# EAGLE design elec - pi pico (EAGLE 9.6.2)
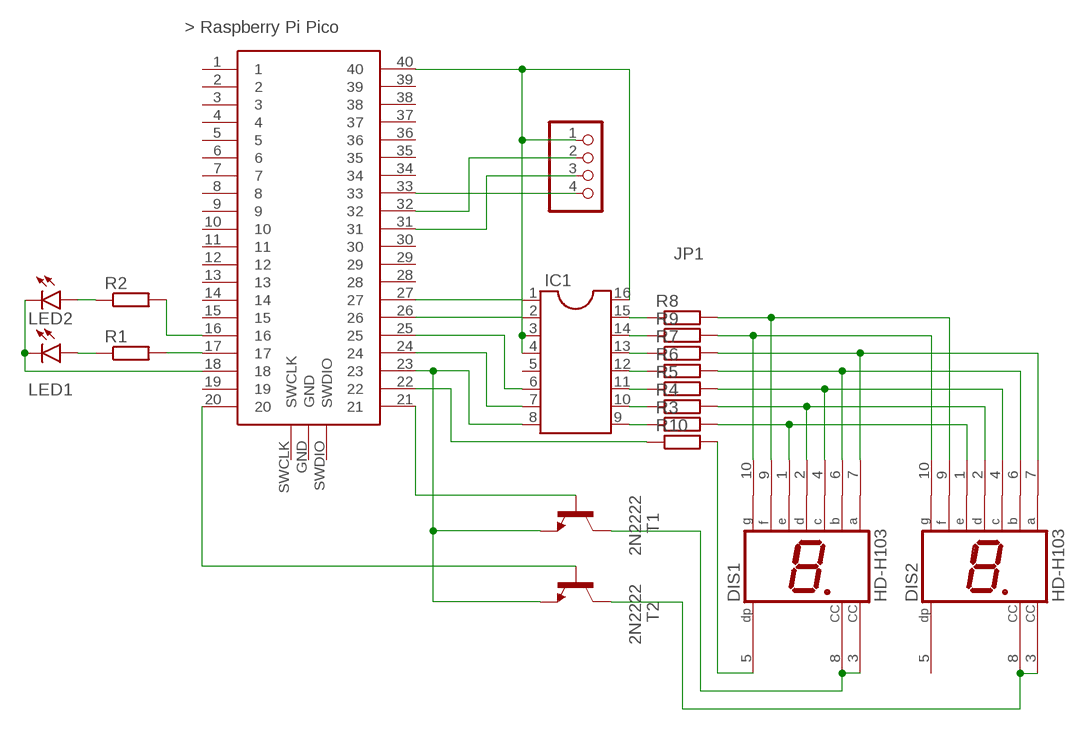
[diagram p0: schematic, sheet 1]

## Parts
DIS1  HD-H103  [HDSP-M]
DIS2  HD-H103  [HDSP-M]
IC1  DIL16  [DIL16]
JP1  PINHD-1X4  [1X04]
LED1  LED5MM  [LED5MM]
LED2  LED5MM  [LED5MM]
R1  R-EU_0204/2V  [0204V]
R2  R-EU_0204/2V  [0204V]
R3  R-EU_0204/2V  [0204V]
R4  R-EU_0204/2V  [0204V]
R5  R-EU_0204/2V  [0204V]
R6  R-EU_0204/2V  [0204V]
R7  R-EU_0204/2V  [0204V]
R8  R-EU_0204/2V  [0204V]
R9  R-EU_0204/2V  [0204V]
R10  R-EU_0204/2V  [0204V]
T1  2N2222  [TO18]
T2  2N2222  [TO18]
U$1  RASPBERRY-PI-PICO_TH  [FT_RASPBERRY-PI-PICO_TH]

## Nets
N$1: IC1.15 R8.1
N$2: IC1.14 R9.1
N$3: IC1.13 R7.1
N$4: IC1.12 R6.1
N$5: IC1.11 R5.1
N$6: IC1.10 R4.1
N$7: IC1.9 R3.1
N$8: IC1.1 U$1.27
N$9: IC1.2 U$1.26
N$10: IC1.6 U$1.25
N$11: IC1.7 U$1.24
N$12: DIS1.9(F) DIS2.9(F) R8.2
N$13: DIS1.10(G) DIS2.10(G) R9.2
N$14: DIS1.7(A) DIS2.7(A) R7.2
N$15: DIS1.6(B) DIS2.6(B) R6.2
N$16: DIS1.4(C) DIS2.4(C) R5.2
N$17: DIS1.2(D) DIS2.2(D) R4.2
N$18: DIS1.1(E) DIS2.1(E) R3.2
N$19: IC1.3 IC1.4 IC1.16 JP1.1 U$1.40
N$20: IC1.8 T1.1(E) T2.1(E) U$1.23
N$21: JP1.2 U$1.32
N$22: JP1.3 U$1.31
N$23: JP1.4 U$1.33
N$24: DIS1.3(CC) DIS1.8(CC) T1.3(C)
N$25: DIS2.3(CC) DIS2.8(CC) T2.3(C)
N$26: DIS1.5(DP) R10.2
N$27: R10.1 U$1.22
N$28: T2.2(B) U$1.20
N$29: R1.2 U$1.17
N$30: T1.2(B) U$1.21
N$31: R2.2 U$1.16
N$32: LED2.A R2.1
N$33: LED1.A R1.1
N$34: LED1.K(C) LED2.K(C) U$1.18
Unconnected: DIS2.5(DP) IC1.5 U$1.1 U$1.2 U$1.3 U$1.4 U$1.5 U$1.6 U$1.7 U$1.8 U$1.9 U$1.10 U$1.11 U$1.12 U$1.13 U$1.14 U$1.15 U$1.19 U$1.28 U$1.29 U$1.30 U$1.34 U$1.35 U$1.36 U$1.37 U$1.38 U$1.39 U$1.GND U$1.SWCLK U$1.SWDIO

## Library data of the parts
DIS1 DIS2 = display-hp:HD-H103: LED DISPLAY 1-character 7 segment, decimal point right; OC_FARNELL: unknown; OC_NEWARK: unknown
IC1 = ic-package:DIL16: Dual In Line / Socket
JP1 = pinhead:PINHD-1X4: PIN HEADER
LED1 LED2 = led:LED: LED OSRAM: - CHIPLED LG R971, LG N971, LY N971, LG Q971, LY Q971, LO R971, LY R971 LH N974, LH R974 LS Q976, LO Q976, LY Q976 LO Q996 - Hyper CHIPLED LW Q18S LB Q993, LB Q99A, LB R99A - SideLED LS A670, LO A670, LY A670, LG A670, LP A670 LB A673, LV A673, LT A673, LW A673 LH A674 LY A675 LS A676, LA A676, LO A676, LY A676, LW A676 LS A679, LY A679, LG A679 - Hyper Micro SIDELED® LS Y876, LA Y876, LO Y876, LY Y876 LT Y87S - SmartLED LW L88C, LW L88S LB L89C, LB L89S, LG L890 LS L89K, LO L89K, LY L89K LS L896, LA L896, LO L896, LY L896 - TOPLED LS T670, LO T670, LY T670, LG T670, LP T670 LSG T670, LSP T670, LSY T670, LOP T670, LYG T670 LG T671, LOG T671, LSG T671 LB T673, LV T673, LT T673, LW T673 LH T674 LS T676, LA T676, LO T676, LY T676, LB T676, LH T676, LSB T676, LW T676 LB T67C, LV T67C, LT T67C, LS T67K, LO T67K, LY T67K, LW E67C LS E67B, LA E67B, LO E67B, LY E67B, LB E67C, LV E67C, LT E67C LW T67C LS T679, LY T679, LG T679 LS T770, LO T770, LY T770, LG T770, LP T770 LB T773, LV T773, LT T773, LW T773 LH T774 LS E675, LA E675, LY E675, LS T675 LS T776, LA T776, LO T776, LY T776, LB T776 LHGB T686 LT T68C, LB T68C - Hyper Mini TOPLED® LB M676 - Mini TOPLED Santana® LG M470 LS M47K, LO M47K, LY M47K Source: http://www.osram.convergy.de LUXEON: - LUMILED® LXK2-PW12-R00, LXK2-PW12-S00, LXK2-PW14-U00, LXK2-PW14-V00 LXK2-PM12-R00, LXK2-PM12-S00, LXK2-PM14-U00 LXK2-PE12-Q00, LXK2-PE12-R00, LXK2-PE12-S00, LXK2-PE14-T00, LXK2-PE14-U00 LXK2-PB12-K00, LXK2-PB12-L00, LXK2-PB12-M00, LXK2-PB14-N00, LXK2-PB14-P00, LXK2-PB14-Q00 LXK2-PR12-L00, LXK2-PR12-M00, LXK2-PR14-Q00, LXK2-PR14-R00 LXK2-PD12-Q00, LXK2-PD12-R00, LXK2-PD12-S00 LXK2-PH12-R00, LXK2-PH12-S00 LXK2-PL12-P00, LXK2-PL12-Q00, LXK2-PL12-R00 Source: www.luxeon.com KINGBRIGHT: KA-3528ASYC Source: www.kingbright.com
R1-R10 = rcl:R-EU_: RESISTOR, European symbol; SPICEPREFIX: R
T1 T2 = transistor:2N2222: NPN TRANSISTOR
U$1 = pipico:RASPBERRY-PI-PICO_TH: Raspberry Pi Pico microcontroller board for through-hole mounting.

## Board
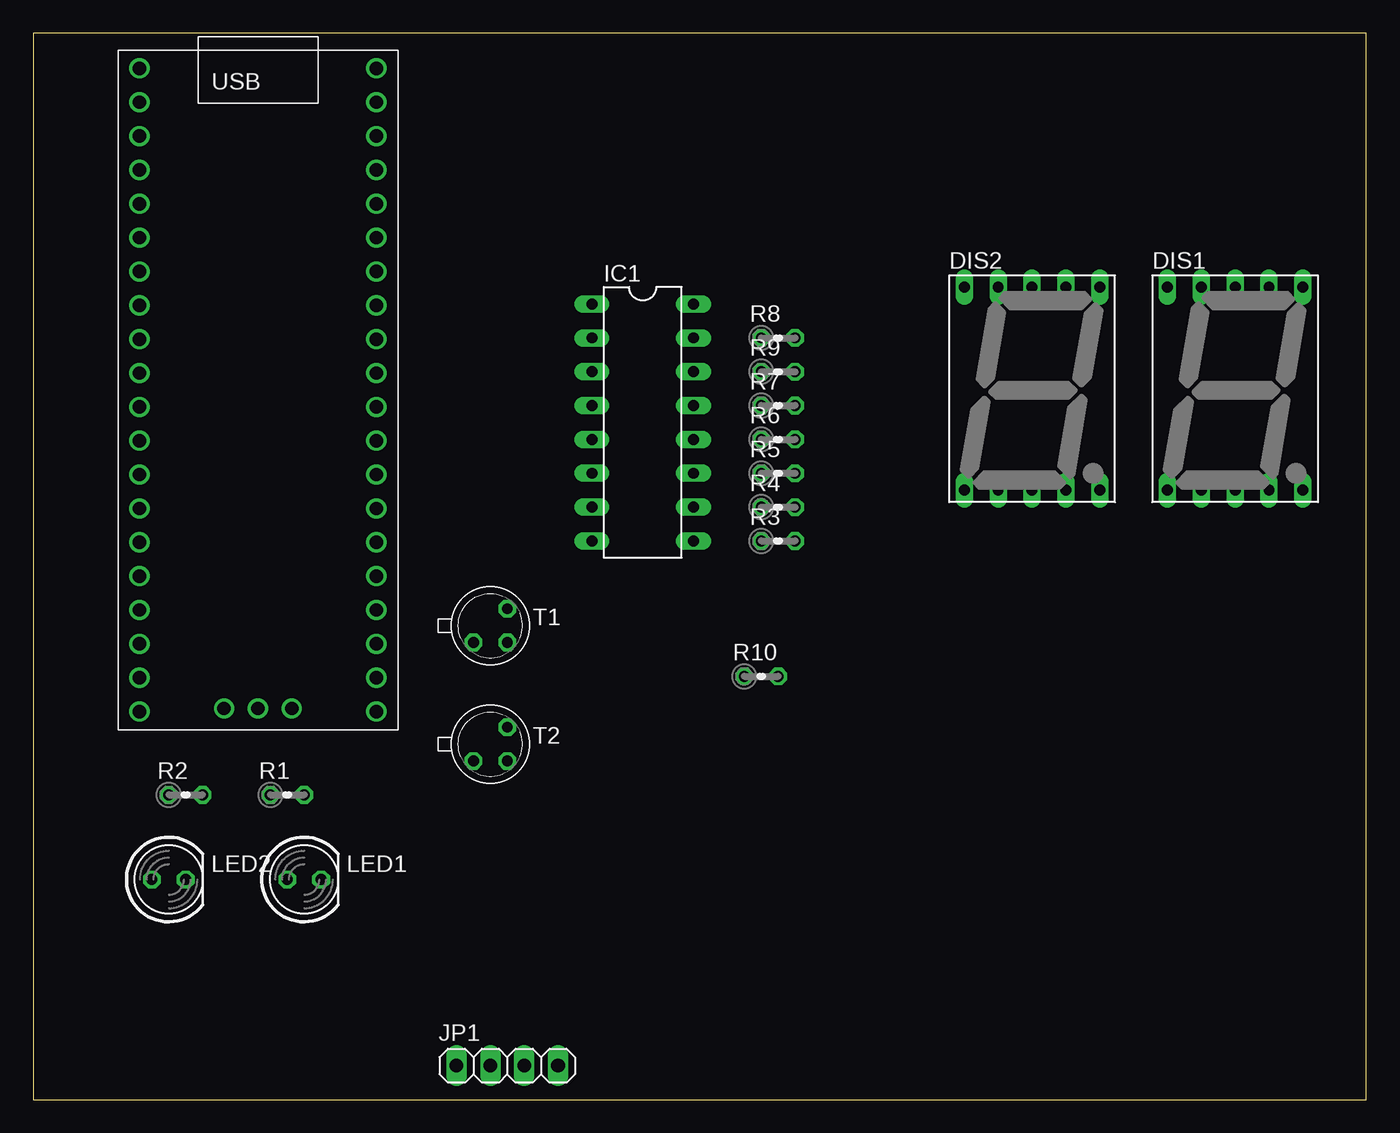
[diagram p1: board, top side]
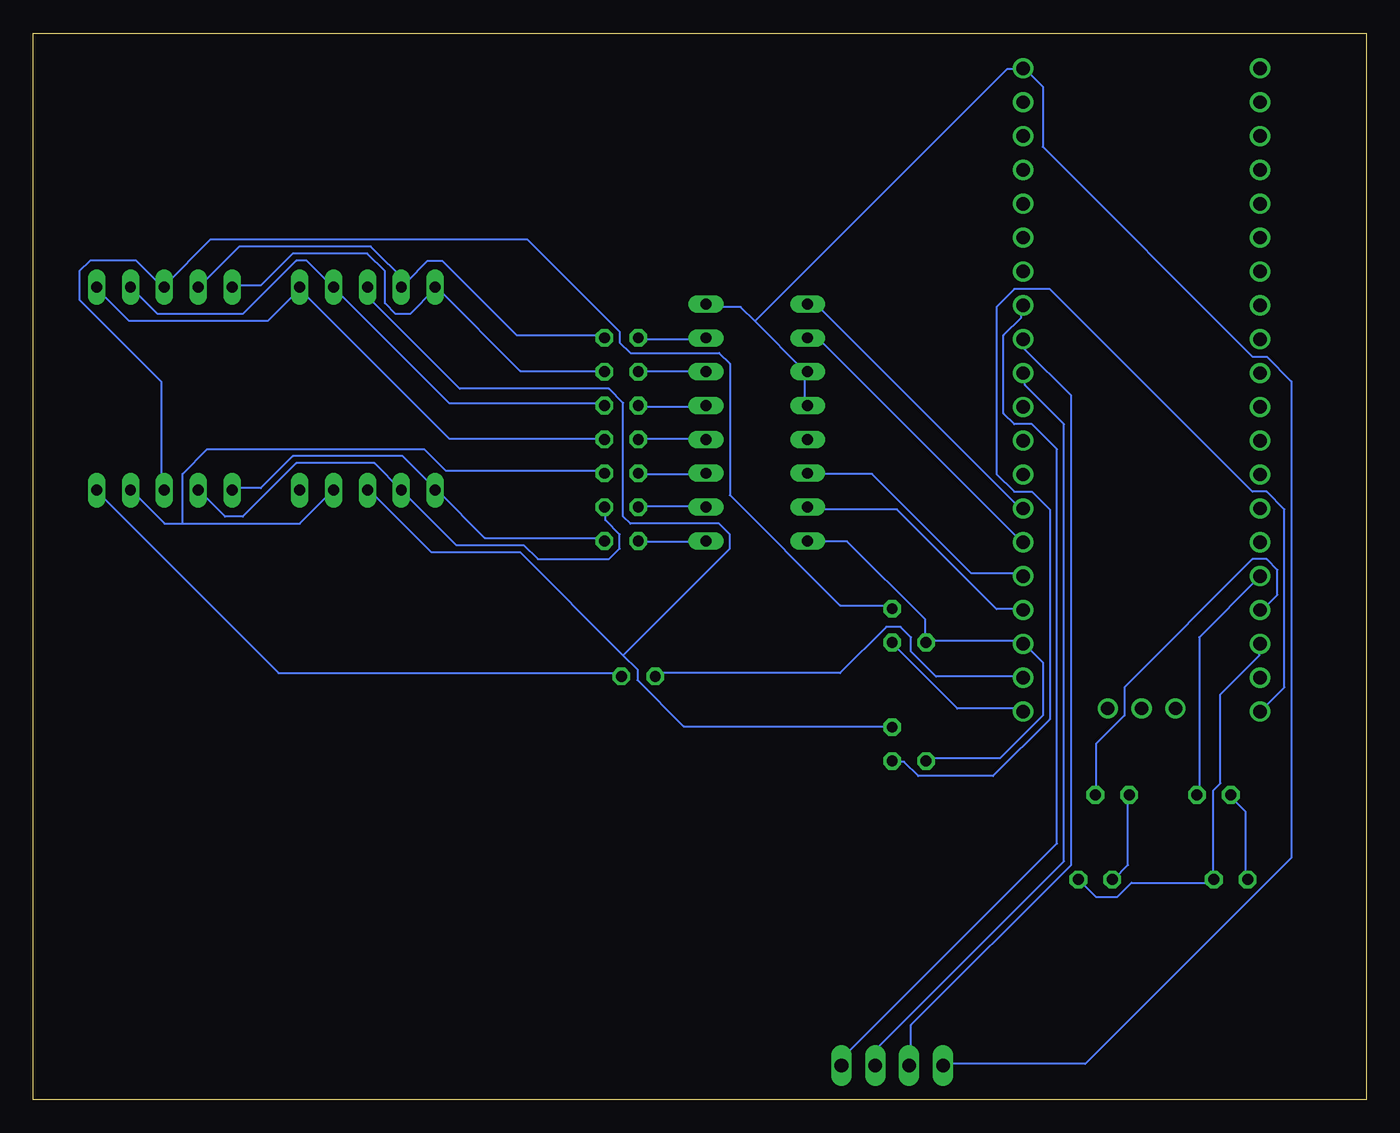
[diagram p2: board, bottom side, seen from below]

Size 100 x 80 mm. Coordinates in mm from the lower left corner, seen from the top.
Outline: 0,0 100,0 100,80 0,80 0,0
Copper layers (1*16): Top 0.035mm / dielectric 1.5mm / Bottom 0.035mm
Design rules "default *": minimum track width 6mil, minimum drill 0.35mm, track to track 15mil, track to pad 15mil, pad to pad 15mil, via to via 15mil, smd to smd 15mil, copper to edge 40mil, drill to drill 6mil, minimum pad ring 10mil, minimum via ring 8mil, stop-mask expansion 4mil, vias tented up to drill 0mil, thermal gap 10mil

### Footprints (pad centres in the part's own frame; a part is rotated, then mirrored left to right if it is on the bottom)
HDSP-M = drill 0.813 long: 1 -5.08,-7.62; 2 -2.54,-7.62; 3 0,-7.62; 4 2.54,-7.62; 5 5.08,-7.62; 6 5.08,7.62; 7 2.54,7.62; 8 0,7.62; 9 -2.54,7.62; 10 -5.08,7.62
DIL16 = drill 0.813 long: 1 -8.89,-3.81; 2 -6.35,-3.81; 3 -3.81,-3.81; 4 -1.27,-3.81; 5 1.27,-3.81; 6 3.81,-3.81; 7 6.35,-3.81; 8 8.89,-3.81; 9 8.89,3.81; 10 6.35,3.81; 11 3.81,3.81; 12 1.27,3.81; 13 -1.27,3.81; 14 -3.81,3.81; 15 -6.35,3.81; 16 -8.89,3.81
1X04 = drill 1.016 long: 1 -3.81,0; 2 -1.27,0; 3 1.27,0; 4 3.81,0
LED5MM = drill 0.813 octagon: A -1.27,0; K 1.27,0
0204V = drill 0.813 octagon: 1 -1.27,0; 2 1.27,0
TO18 = drill 0.813 octagon: 1 -1.27,-1.27; 2 1.27,-1.27; 3 1.27,1.27
FT_RASPBERRY-PI-PICO_TH = drill 1: 1 -8.55,24.03; 2 -8.55,21.49; 3 -8.55,18.95; 4 -8.55,16.41; 5 -8.55,13.87; 6 -8.55,11.33; 7 -8.55,8.79; 8 -8.55,6.25; 9 -8.55,3.71; 10 -8.55,1.17; 11 -8.55,-1.37; 12 -8.55,-3.91; 13 -8.55,-6.45; 14 -8.55,-8.99; 15 -8.55,-11.53; 16 -8.55,-14.07; 17 -8.55,-16.61; 18 -8.55,-19.15; 19 -8.55,-21.69; 20 -8.55,-24.23; 21 9.23,-24.23; 22 9.23,-21.69; 23 9.23,-19.15; 24 9.23,-16.61; 25 9.23,-14.07; 26 9.23,-11.53; 27 9.23,-8.99; 28 9.23,-6.45; 29 9.23,-3.91; 30 9.23,-1.37; 31 9.23,1.17; 32 9.23,3.71; 33 9.23,6.25; 34 9.23,8.79; 35 9.23,11.33; 36 9.23,13.87; 37 9.23,16.41; 38 9.23,18.95; 39 9.23,21.49; 40 9.23,24.03; GND 0.34,-24; SWCLK -2.2,-24; SWDIO 2.88,-24

### Placement (x,y rotation side)
DIS1  90.17,53.34 0 top
DIS2  74.93,53.34 0 top
IC1  45.72,50.8 270 top
JP1  35.56,2.54 0 top
LED1  20.32,16.51 0 top
LED2  10.16,16.51 0 top
R1  19.05,22.86 0 top
R2  11.43,22.86 0 top
R3  55.88,41.91 0 top
R4  55.88,44.45 0 top
R5  55.88,46.99 0 top
R6  55.88,49.53 0 top
R7  55.88,52.07 0 top
R8  55.88,57.15 0 top
R9  55.88,54.61 0 top
R10  54.61,31.75 0 top
T1  34.29,35.56 0 top
T2  34.29,26.67 0 top
U$1  16.51,53.34 0 top

### Tracks (layer width: path | path; a pad name or v marks a point on that pad's centre or on a via)
N$1
  Bottom 0.152: IC1.15 49.61,57.07 54.41,57.07 R8.1
N$2
  Bottom 0.152: IC1.14 49.61,54.67 54.41,54.67 R9.1
N$3
  Bottom 0.152: IC1.13 49.61,52.01 54.41,52.01 R7.1
N$4
  Bottom 0.152: IC1.12 49.61,49.61 54.41,49.61 R6.1
N$5
  Bottom 0.152: IC1.11 49.61,46.94 54.41,46.94 R5.1
N$6
  Bottom 0.152: IC1.10 49.61,44.54 54.41,44.54 R4.1
N$7
  Bottom 0.152: IC1.9 49.61,41.87 54.41,41.87 R3.1
N$8
  Bottom 0.152: IC1.1 41.87,59.47 41.07,59.47 25.87,44.27 U$1.27
N$9
  Bottom 0.152: IC1.2 41.87,57.07 41.07,57.07 25.87,41.87 U$1.26
N$10
  Bottom 0.152: IC1.6 41.87,46.94 37.07,46.94 29.6,39.47 25.87,39.47 U$1.25
N$11
  Bottom 0.152: IC1.7 41.87,44.27 35.2,44.27 27.74,36.8 25.87,36.8 U$1.24
N$12
  Bottom 0.152: 72.01,61.34 DIS2.9 72.28,61.07 | 72.01,61.34 70.41,62.94 69.34,62.94 63.74,57.34 57.34,57.34 R8.2 | 72.01,61.34 74.68,64.01 84.54,64.01 87.48,61.07 DIS1.9
N$13
  Bottom 0.152: R9.2 57.34,54.67 63.48,54.67 69.61,60.81 DIS2.10 69.88,60.81 71.74,58.94 72.81,58.94 73.61,59.74 73.61,62.14 74.94,63.48 80.54,63.48 82.94,61.07 85.08,61.07 DIS1.10
N$14
  Bottom 0.152: R7.2 57.34,52.27 68.81,52.27 77.34,60.81 DIS2.7 77.61,61.07 79.48,62.94 80.28,62.94 84.28,58.94 90.68,58.94 92.55,60.81 DIS1.7
N$15
  Bottom 0.152: 80.01,60.81 68.81,49.61 57.34,49.61 R6.2 | 80.01,60.81 82.41,58.41 92.81,58.41 95.21,60.81 DIS1.6 | 80.01,60.81 DIS2.6
N$16
  Bottom 0.152: 88.81,43.2 90.14,43.2 92.55,45.61 DIS1.4 | 88.81,43.2 80.01,43.2 77.61,45.61 DIS2.4 | 88.81,43.2 88.81,46.94 86.94,48.81 70.67,48.81 69.08,47.21 57.34,47.21 R5.2
N$17
  Bottom 0.152: R4.2 57.07,44.27 57.07,43.47 56.01,42.41 56.01,41.34 56.81,40.54 62.14,40.54 63.21,41.6 68.28,41.6 DIS2.2 74.41,47.74 80.28,47.74 84.28,43.74 85.61,43.74 87.48,45.61 DIS1.2
N$18
  Bottom 0.152: R3.2 57.34,42.14 66.14,42.14 69.61,45.61 DIS2.1 69.88,45.87 72.28,48.27 80.54,48.27 82.94,45.87 85.08,45.87 DIS1.1
N$19
  Bottom 0.152: IC1.4 42.14,52.27 42.14,54.41 IC1.3 42.14,54.67 45.87,58.41 | 45.87,58.41 46.94,59.47 49.34,59.47 IC1.16 | 45.87,58.41 26.94,77.34 25.87,77.34 U$1.40 25.6,77.34 24.27,76.01 24.27,71.48 8.53,55.74 7.47,55.74 5.6,53.87 5.6,18.14 21.07,2.67 31.74,2.67 JP1.1
N$20
  Bottom 0.152: T2.1 32.8,25.6 27.47,25.6 24.27,28.8 24.27,32.8 25.6,34.14 U$1.23 25.87,34.4 32.8,34.4 T1.1 33.07,34.4 33.07,36.01 38.94,41.87 41.87,41.87 IC1.8
N$21
  Bottom 0.152: U$1.32 25.6,56.81 25.6,56.27 22.14,52.81 22.14,17.6 34.14,5.6 34.14,2.67 JP1.2
N$22
  Bottom 0.152: U$1.31 25.6,54.41 25.6,53.61 22.67,50.67 22.67,17.87 36.8,3.73 36.8,2.67 JP1.3
N$23
  Bottom 0.152: U$1.33 25.87,59.47 25.87,58.67 27.2,57.34 27.2,51.47 26.4,50.67 25.07,50.67 23.2,48.81 23.2,19.2 39.2,3.2 39.2,2.67 JP1.4
N$24
  Bottom 0.152: T1.3 35.74,37.07 39.47,37.07 47.74,45.34 47.74,55.21 48.54,56.01 55.21,56.01 56.01,56.81 56.01,57.61 62.94,64.54 86.68,64.54 90.14,61.07 DIS1.8 90.41,61.07 92.28,62.94 95.75,62.94 96.55,62.14 96.55,60.01 90.41,53.87 90.41,45.87 DIS1.3
N$25
  Bottom 0.152: 55.74,33.34 63.48,41.07 70.14,41.07 74.68,45.61 DIS2.3 | 55.74,33.34 54.67,32.27 54.67,31.47 51.21,28 35.74,28 T2.3 | 55.74,33.34 47.74,41.34 47.74,42.41 48.54,43.2 55.21,43.2 55.74,43.74 55.74,52.27 56.81,53.34 68.01,53.34 74.68,60.01 74.68,60.81 DIS2.8
N$26
  Bottom 0.152: R10.2 56.01,32 81.61,32 95.21,45.61 DIS1.5
N$27
  Bottom 0.152: R10.1 53.34,32 39.47,32 36.01,35.47 34.94,35.47 34.14,34.67 34.14,33.6 32.27,31.74 25.87,31.74 U$1.22
N$28
  Bottom 0.152: T2.2 35.47,25.34 34.67,25.34 33.6,24.27 28,24.27 23.74,28.54 23.74,44.27 25.07,45.61 26.4,45.61 27.74,46.94 27.74,59.47 26.4,60.81 23.74,60.81 8.53,45.61 7.47,45.61 6.13,44.27 6.13,30.94 7.73,29.34 U$1.20
N$29
  Bottom 0.152: R1.2 20.27,22.94 20.27,26.67 18.14,28.8 18.14,30.94 8.53,40.54 7.47,40.54 6.67,39.74 6.67,37.87 7.73,36.8 U$1.17
N$30
  Bottom 0.152: T1.2 35.47,34.14 30.67,29.34 25.87,29.34 U$1.21
N$31
  Bottom 0.152: R2.2 12.54,22.94 12.54,34.67 8,39.2 U$1.16
N$32
  Bottom 0.152: LED2.A 9.07,16.54 9.07,21.6 10.13,22.67 R2.1
N$33
  Bottom 0.152: R1.1 17.87,22.67 17.87,17.6 18.94,16.54 LED1.A
N$34
  Bottom 0.152: LED1.K 21.34,16.27 20.27,15.2 18.67,15.2 17.6,16.27 11.47,16.27 LED2.K 11.47,16.54 11.47,23.2 10.94,23.74 10.94,30.4 8,33.34 8,34.14 U$1.18